# Altium schematic sheet pca10156_sheet1_connections.SchDoc: =BoardTitle+' - Connections'
size A3; Organization: Nordic Semiconductor; DocumentNumber: 1; SheetNumber: 1; SheetTotal: 8; CompanyName: Nordic Semiconductor; DocumentSize: A4
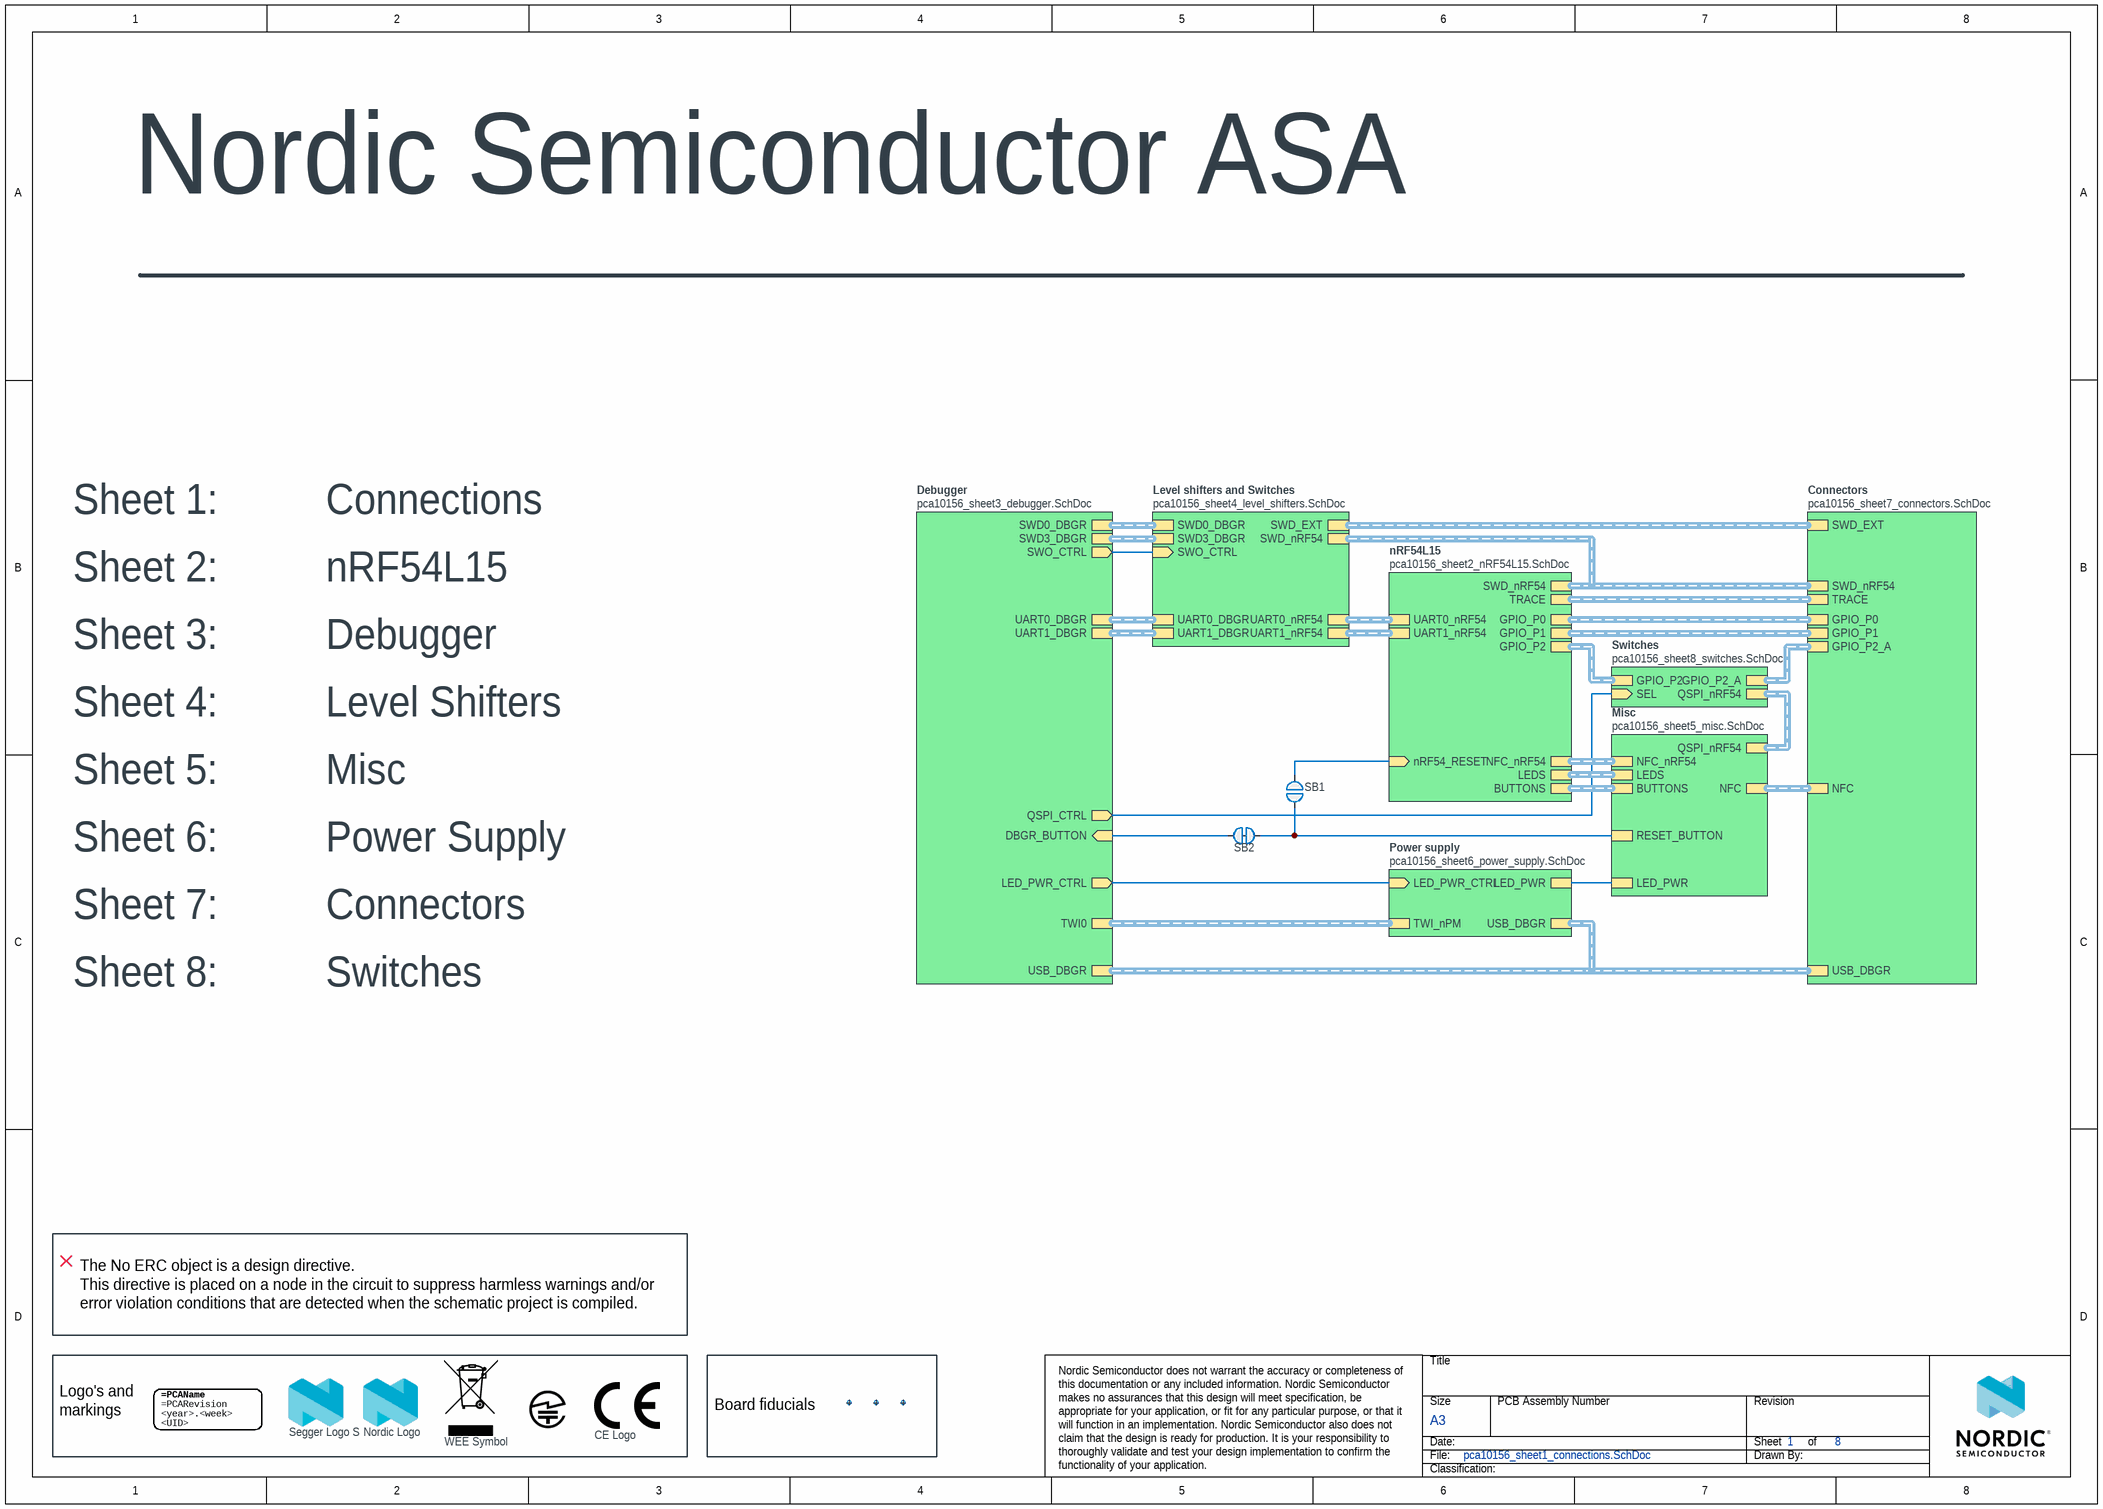
[diagram p0: pca10156_sheet1_connections.SchDoc]

## Parts
Fid1  Fiducial mark  [Fiducial]  (value not drawn)
Fid2  Fiducial mark  [Fiducial]  (value not drawn)
Fid3  Fiducial mark  [Fiducial]  (value not drawn)
LABEL1  12x12mm  [LabelSilk_12x12]  (value not drawn)
LOGO1  Nordic Logo  [NORDIC_LOGO_LYING]  (no BOM)
LOGO2  WEE Symbol  [WEE_3x4.5mm]  (no BOM)
LOGO3  Segger Logo S  [SEGGER_LOGO_S]  (no BOM)
LOGO4  CE Logo  [CE_logo]  (no BOM)
S1  Giteki Symbol  [Giteki]  (value not drawn)  (no BOM)
SB1  Solderbridge  [Solderbridge]  (value not drawn)  (no BOM)
SB2  Solderbridge  [Solderbridge_Shorted]  (value not drawn)  (net tie, no BOM)

## Sub-sheets
Connectors = pca10156_sheet7_connectors.SchDoc: SWD_nRF54 (harness SWD), TRACE (harness TRACE), NFC (harness NFC), SWD_EXT (harness SWD), GPIO_P0 (harness GPIO_P0), GPIO_P1 (harness GPIO_P1), USB_DBGR (harness USB), GPIO_P2_A (harness GPIO_P2)
Debugger = pca10156_sheet3_debugger.SchDoc: DBGR_BUTTON (in), SWD0_DBGR (harness SWD), UART0_DBGR (harness UART_DBGR), USB_DBGR (harness USB), UART1_DBGR (harness UART_DBGR), TWI0 (harness TWI), SWD3_DBGR (harness SWD), LED_PWR_CTRL (out), SWO_CTRL (out), QSPI_CTRL (out)
Level shifters and Switches = pca10156_sheet4_level_shifters.SchDoc: SWD0_DBGR (harness SWD), SWD_EXT (harness SWD), UART0_nRF54 (harness UART), UART1_nRF54 (harness UART), SWD3_DBGR (harness SWD), SWD_nRF54 (harness SWD), UART0_DBGR (harness UART_DBGR), UART1_DBGR (harness UART_DBGR), SWO_CTRL (in)
Misc = pca10156_sheet5_misc.SchDoc: NFC_nRF54 (harness NFC), NFC (harness NFC), BUTTONS (harness UI), LEDS (harness UI), RESET_BUTTON, LED_PWR, QSPI_nRF54
nRF54L15 = pca10156_sheet2_nRF54L15.SchDoc: BUTTONS (harness UI), LEDS (harness UI), TRACE (harness TRACE), NFC_nRF54 (harness NFC), GPIO_P0 (harness GPIO_P0), UART0_nRF54 (harness UART), GPIO_P1 (harness GPIO_P1), GPIO_P2 (harness GPIO_P2), UART1_nRF54 (harness UART), SWD_nRF54 (harness SWD), nRF54_RESET (in)
Power supply = pca10156_sheet6_power_supply.SchDoc: TWI_nPM (harness TWI), LED_PWR_CTRL (in), LED_PWR, USB_DBGR (harness USB)
Switches = pca10156_sheet8_switches.SchDoc: SEL (in), GPIO_P2 (harness GPIO_P2), QSPI_nRF54 (harness QSPI), GPIO_P2_A (harness GPIO_P2)

## Nets
NetSB1_1: SB1.1 ; sheet nRF54L15/nRF54_RESET
NetSB1_2: SB1.2 SB2.1 ; sheet Misc/RESET_BUTTON
NetSB2_2: SB2.2 ; sheet Debugger/DBGR_BUTTON
(unnamed): sheet Debugger/LED_PWR_CTRL, sheet Power supply/LED_PWR_CTRL
(unnamed): sheet Debugger/SWO_CTRL, sheet Level shifters and Switches/SWO_CTRL
(unnamed): sheet Debugger/QSPI_CTRL, sheet Switches/SEL
(unnamed): sheet Misc/LED_PWR, sheet Power supply/LED_PWR

## Buses and harness runs
harness sheet Connectors/GPIO_P0 = sheet nRF54L15/GPIO_P0
harness sheet Connectors/GPIO_P1 = sheet nRF54L15/GPIO_P1
harness sheet Connectors/GPIO_P2_A = sheet Switches/GPIO_P2_A
harness sheet Connectors/NFC = sheet Misc/NFC
harness sheet Connectors/SWD_EXT = sheet Level shifters and Switches/SWD_EXT
harness sheet Connectors/SWD_nRF54 = sheet Level shifters and Switches/SWD_nRF54 = sheet nRF54L15/SWD_nRF54
harness sheet Connectors/TRACE = sheet nRF54L15/TRACE
harness sheet Connectors/USB_DBGR = sheet Debugger/USB_DBGR = sheet Power supply/USB_DBGR
harness sheet Debugger/SWD0_DBGR = sheet Level shifters and Switches/SWD0_DBGR
harness sheet Debugger/SWD3_DBGR = sheet Level shifters and Switches/SWD3_DBGR
harness sheet Debugger/TWI0 = sheet Power supply/TWI_nPM
harness sheet Debugger/UART0_DBGR = sheet Level shifters and Switches/UART0_DBGR
harness sheet Debugger/UART1_DBGR = sheet Level shifters and Switches/UART1_DBGR
harness sheet Level shifters and Switches/UART0_nRF54 = sheet nRF54L15/UART0_nRF54
harness sheet Level shifters and Switches/UART1_nRF54 = sheet nRF54L15/UART1_nRF54
harness sheet Misc/BUTTONS = sheet nRF54L15/BUTTONS
harness sheet Misc/LEDS = sheet nRF54L15/LEDS
harness sheet Misc/NFC_nRF54 = sheet nRF54L15/NFC_nRF54
harness sheet Misc/QSPI_nRF54 = sheet Switches/QSPI_nRF54
harness sheet nRF54L15/GPIO_P2 = sheet Switches/GPIO_P2

## Notes on the sheet
- Sheet 1:          Connections
- Sheet 2:          nRF54L15
- Sheet 4:          Level Shifters
- Sheet 3:          Debugger
- Sheet 5:          Misc
- Sheet 6:          Power Supply
- Sheet 7:          Connectors
- Sheet 8:          Switches
- The No ERC object is a design directive.
  This directive is placed on a node in the circuit to suppress harmless warnings and/or error violation conditions that are detected when the schematic project is compiled.
- (near LABEL1) Logo's and markings
- (near Fid1) Board fiducials
- Nordic Semiconductor ASA
- Title
- Size
- Date:
- File:
- A3
- PCB Assembly Number
- Sheet
- Drawn By:
- Revision
- of
- Nordic Semiconductor does not warrant the accuracy or completeness of this documentation or any included information. Nordic Semiconductor makes no assurances that this design will meet specification, be appropriate for your application, or fit for any particular purpose, or that it will function in an implementation. Nordic Semiconductor also does not claim that the design is ready for production. It is your responsibility to thoroughly validate and test your design implementation to confirm the functionality of your application.
  © Nordic Semiconductor — All rights reserved.
- Classification:
- (in symbol Label_12x12) <year>.<week>; <UID>

## Library data of the parts
Fid1-Fid3 = Fid-Mark: Manufacturer: N.A.; Part number NEMS: 100500073; Value: N.A.; Pad Count: 1; Component Status: Active; System: Connector; Part Number: Fid-Mark; Manufacturer Part Number: N.A.; LatestRevisionDate: 2009-12-12; Published: 2009-12-12; Note: N.A.; Artikkelnr Noca: N.A.; Footprint Doc: Fiducial; Part number IPS: N.A.; ComponentLink1URL: N.A.; ComponentLink1Description: Datasheet; ComponentLink2URL: N.A.; ComponentLink2Description: Supplier link; HelpURL: N.A.; Supplier 1: N.A.; Supplier Part Number 1: N.A.; Supplier 2: N.A.; Supplier Part Number 2: N.A.; PartId: 100500073; Component Class: Connectors; Author: rsk; Part number Norautron: N.A.
LABEL1 = Label_12x12: PCA version label, stick-on, 12x12mm; Manufacturer: Ellco Etikett; Manufacturer Part Number: A33512‐01; Part number NEMS: 101200028; Component Status: Active; Pad Count: 0; Note: N.A.; Part Number: Label_12x12; PartId: 101200028; Component Class: Mechanicals; Author: hany; ComponentLink1URL: N.A.; ComponentLink1Description: Datasheet; ComponentLink2URL: N.A.; ComponentLink2Description: Supplier link; HelpURL: N.A.; LatestRevisionDate: 2023-01-05; Published: 2023-01-05; Footprint Doc: Label; Value: 12x12mm; Supplier 1: N.A.; Supplier Part Number 1: N.A.; Supplier 2: N.A.; Supplier Part Number 2: N.A.; Artikkelnr Noca: N.A.; Part number IPS: N.A.; Part number Norautron: N.A.
LOGO1 = Nordic Logo lying: Manufacturer: N.A.; Part number NEMS: 101100001; Component Status: Active; Pad Count: 0; Part Number: Nordic Logo lying; PartId: 101100001; Component Class: Markings; Author: rsk; Manufacturer Part Number: N.A.; ComponentLink1URL: N.A.; ComponentLink1Description: Datasheet; ComponentLink2URL: N.A.; ComponentLink2Description: Supplier link; HelpURL: N.A.; LatestRevisionDate: 2017-03-20; Published: 2017-09-01; Footprint Doc: Nordic Logo; Value: Nordic Logo; Note: N.A.; Supplier 1: N.A.; Supplier Part Number 1: N.A.; Supplier 2: N.A.; Supplier Part Number 2: N.A.; Artikkelnr Noca: N.A.; Part number IPS: N.A.; Part number Norautron: N.A.
LOGO2 = WEEE Symbol 3x4.5mm: WEEE Directive symbol; Manufacturer: N.A.; Part number NEMS: 101100006; Component Status: Active; Pad Count: 0; Part Number: WEEE Symbol 3x4.5mm; PartId: 101100006; Component Class: Markings; Author: rsk; Manufacturer Part Number: N.A.; ComponentLink1URL: N.A.; ComponentLink1Description: Datasheet; ComponentLink2URL: N.A.; ComponentLink2Description: Supplier link; HelpURL: N.A.; LatestRevisionDate: 2023-03-07; Published: 2016-09-07; Footprint Doc: WEE_3x4.5mm; Value: WEE Symbol; Note: N.A.; Supplier 1: N.A.; Supplier Part Number 1: N.A.; Supplier 2: N.A.; Supplier Part Number 2: N.A.; Artikkelnr Noca: N.A.; Part number IPS: N.A.; Part number Norautron: N.A.
LOGO3 = Segger Logo S: Segger logo, small size; Manufacturer: N.A.; Part number NEMS: 101100004; Component Status: Active; Pad Count: 0; Part Number: Segger Logo S; PartId: 101100004; Component Class: Markings; Author: rsk; Manufacturer Part Number: N.A.; ComponentLink1URL: N.A.; ComponentLink1Description: Datasheet; ComponentLink2URL: N.A.; ComponentLink2Description: Supplier link; HelpURL: N.A.; LatestRevisionDate: 2016-09-07; Published: 2016-09-07; Footprint Doc: Segger Logo S; Value: Segger Logo S; Note: N.A.; Supplier 1: N.A.; Supplier Part Number 1: N.A.; Supplier 2: N.A.; Supplier Part Number 2: N.A.; Artikkelnr Noca: N.A.; Part number IPS: N.A.; Part number Norautron: N.A.
LOGO4 = CE_logo: CE (Conformité_Européenne) logo; Manufacturer: N.A.; Part number NEMS: 101100010; Component Status: Active; Pad Count: 0; Part Number: CE_logo; PartId: 101100010; Component Class: Markings; Author: daba; Manufacturer Part Number: N.A.; ComponentLink1URL: N.A.; ComponentLink1Description: Datasheet; ComponentLink2URL: N.A.; ComponentLink2Description: Supplier link; HelpURL: N.A.; LatestRevisionDate: 2024-11-26; Published: 2024-11-26; Footprint Doc: CE_logo; Value: CE Logo; Note: N.A.; Supplier 1: N.A.; Supplier Part Number 1: N.A.; Supplier 2: N.A.; Supplier Part Number 2: N.A.; Artikkelnr Noca: N.A.; Part number IPS: N.A.; Part number Norautron: N.A.
S1 = Giteki Symbol: Manufacturer: N.A.; Part number NEMS: 101100011; Component Status: Active; Pad Count: 0; Part Number: Giteki Symbol; PartId: 101100011; Component Class: Markings; Author: getr; Manufacturer Part Number: N.A.; ComponentLink1URL: N.A.; ComponentLink1Description: Datasheet; ComponentLink2URL: N.A.; ComponentLink2Description: Supplier link; HelpURL: N.A.; LatestRevisionDate: 2025-02-28; Published: 2025-02-28; Footprint Doc: Giteki Symbol; Value: Giteki Symbol; Note: N.A.; Supplier 1: N.A.; Supplier Part Number 1: N.A.; Supplier 2: N.A.; Supplier Part Number 2: N.A.; Artikkelnr Noca: N.A.; Part number IPS: N.A.; Part number Norautron: N.A.
SB1 = Solderbridge: Manufacturer: N.A.; Part number NEMS: 100500458; Pad Count: 2; Component Status: Active; System: Connector; Part Number: Solderbridge; Manufacturer Part Number: N.A.; LatestRevisionDate: 2009-12-14; Published: 2009-12-14; Value: Solderbridge; Note: N.A.; Artikkelnr Noca: N.A.; Footprint Doc: Solderbridge; Part number IPS: N.A.; ComponentLink1URL: N.A.; ComponentLink1Description: Datasheet; ComponentLink2URL: N.A.; ComponentLink2Description: Supplier link; HelpURL: N.A.; Supplier 1: N.A.; Supplier Part Number 1: N.A.; Supplier 2: N.A.; Supplier Part Number 2: N.A.; Component Class: Connectors; PartId: 100500458; Author: rsk; Part number Norautron: N.A.
SB2 = Solderbridge Shorted: Shorted Solderbridge; Manufacturer: N.A.; Part number NEMS: 100500459; Pad Count: 2; Component Status: Active; System: Connector; Part Number: Solderbridge Shorted; Manufacturer Part Number: N.A.; LatestRevisionDate: 2012-08-07; Published: 2012-08-07; Value: Solderbridge; Note: N.A.; Artikkelnr Noca: N.A.; Footprint Doc: Solderbridge_Shorted; Part number IPS: N.A.; ComponentLink1URL: N.A.; ComponentLink1Description: Datasheet; ComponentLink2URL: N.A.; ComponentLink2Description: Supplier link; HelpURL: N.A.; Supplier 1: N.A.; Supplier Part Number 1: N.A.; Supplier 2: N.A.; Supplier Part Number 2: N.A.; Component Class: Connectors; PartId: 100500459; Author: rsk; Part number Norautron: N.A.